# EAGLE design Transient tester r2B1 (EAGLE 6.1)
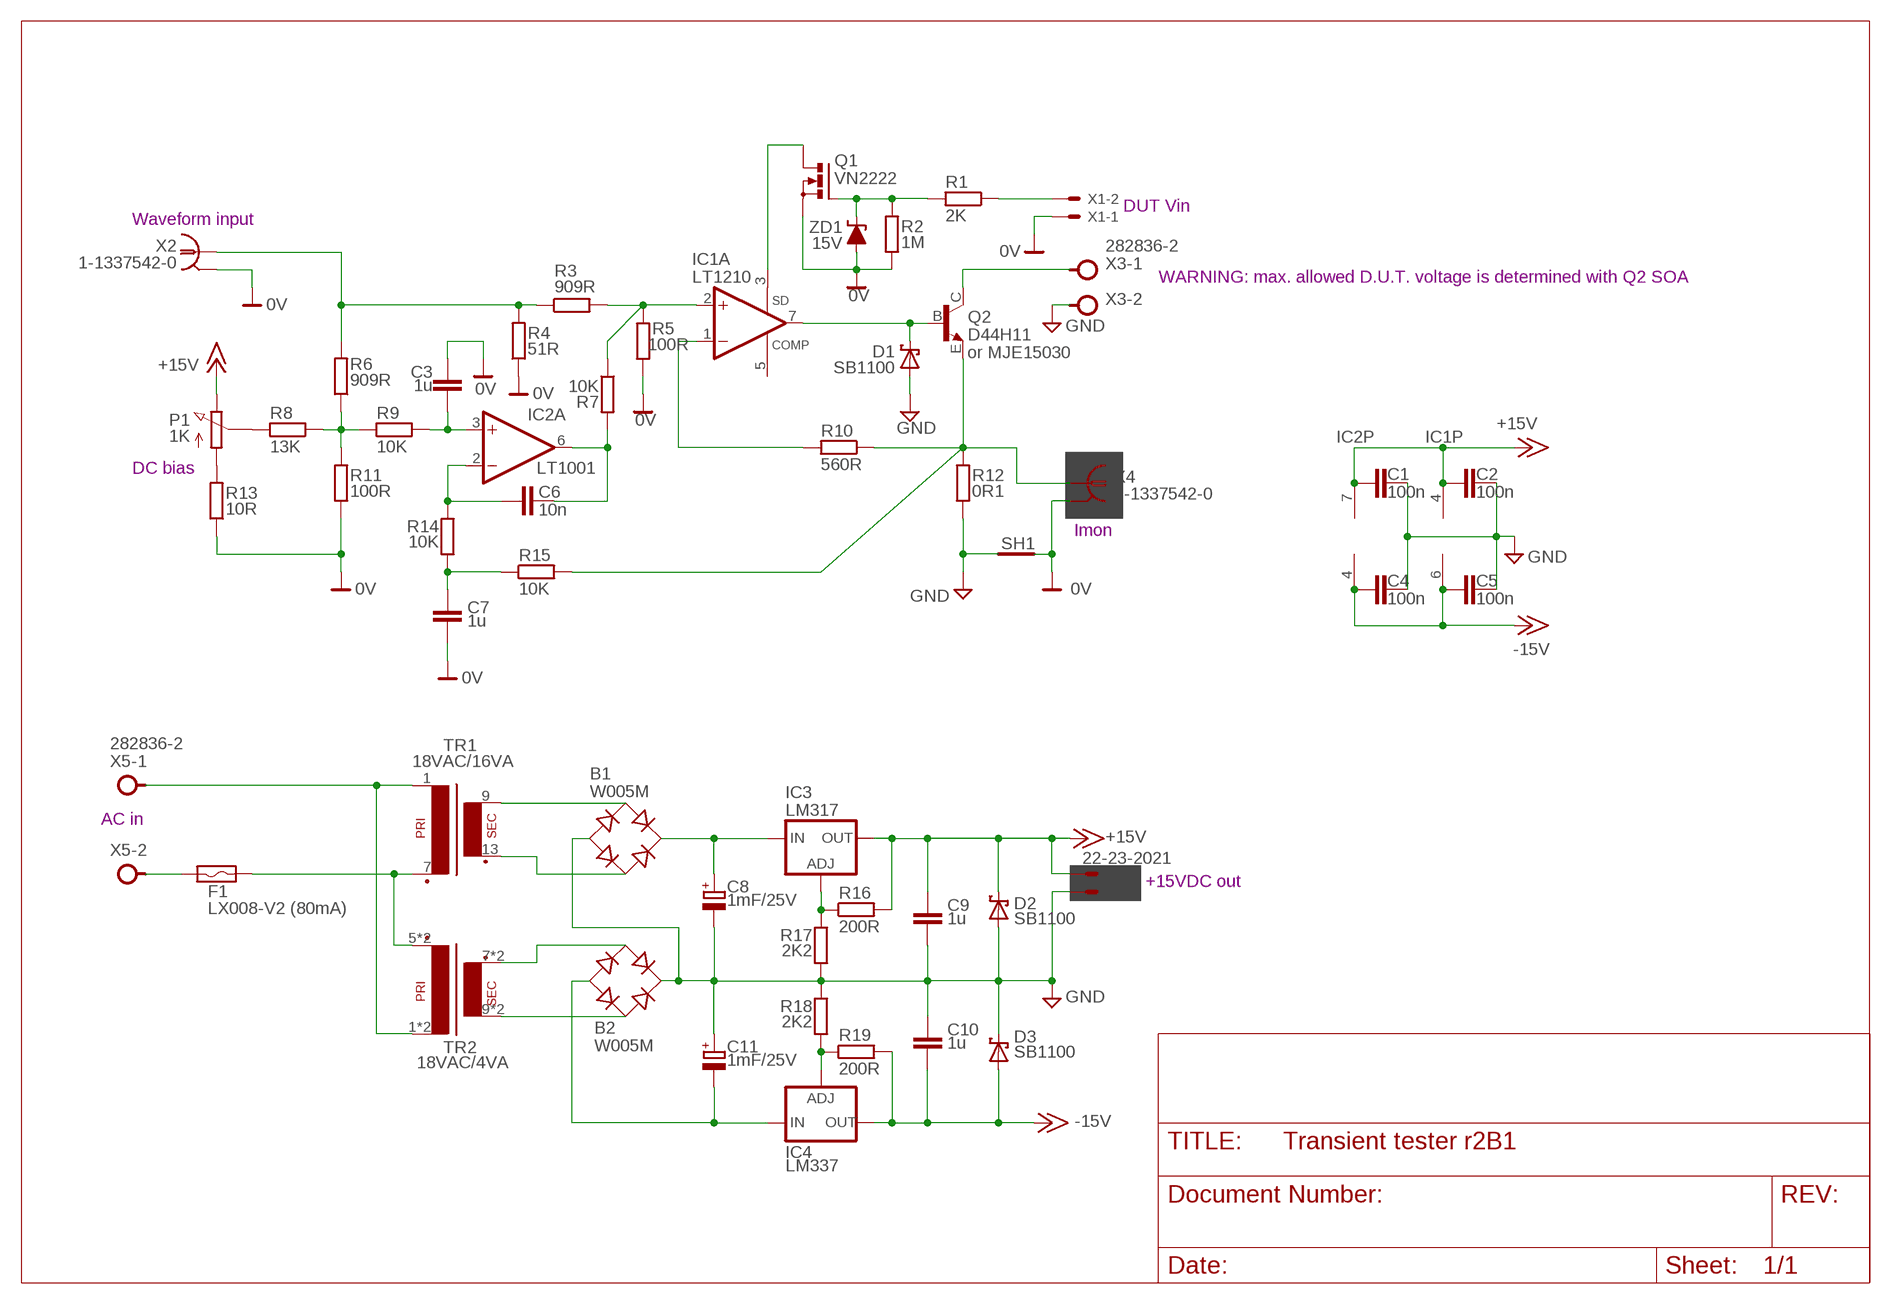
[diagram p0: schematic, sheet 1]

## Parts
B1  W005M  RECTIFIER-RB1A  [RB1A]
B2  W005M  RECTIFIER-RB1A  [RB1A]
C1  100n  C-EU050-025X075  [C050-025X075]
C2  100n  C-EU050-025X075  [C050-025X075]
C3  1u  C-EU050-075X075  [C050-075X075]
C4  100n  C-EU050-025X075  [C050-025X075]
C5  100n  C-EU050-025X075  [C050-025X075]
C6  10n  C-EU050-025X075  [C050-025X075]
C7  1u  C-EU050-075X075  [C050-075X075]
C8  1mF/25V  ECAP5G_10.5MM  [ECAP5/10.5]
C9  1u  C-EU050-025X075  [C050-025X075]
C10  1u  C-EU050-025X075  [C050-025X075]
C11  1mF/25V  ECAP5G_10.5MM  [ECAP5/10.5]
D1  SB1100  SCHOTTKY  [DO34/10]
D2  SB1100  SCHOTTKY  [DO34/10]
D3  SB1100  SCHOTTKY  [DO34/10]
F1  LX008-V2 (80mA)  FUSE_RESETTABLER7  [POLYSWITCH-R7]
IC1  LT1210  [TO220-7]
IC2  LT1001  [DIL08D]
IC3  LM317  LM317TS  [317TS]
IC4  LM337  LM337TS  [337TS]
P1  1K  POTENTIOMETER  [BOURNS_POT91]
Q1  VN2222  2N7000  [TO92-SGD]
Q2  D44H11  [TO220BV]
R1  2K  R-EU_0204/5  [0204/5]
R2  1M  R-EU_0204/5  [0204/5]
R3  909R  R-EU_0207/10  [0207/10]
R4  51R  R-EU_0204/5  [0204/5]
R5  100R  R-EU_0204/5  [0204/5]
R6  909R  R-EU_0207/10  [0207/10]
R7  10K  R-EU_0204/5  [0204/5]
R8  13K  R-EU_0204/5  [0204/5]
R9  10K  R-EU_0204/5  [0204/5]
R10  560R  R-EU_0204/5  [0204/5]
R11  100R  R-EU_0204/5  [0204/5]
R12  0R1  R_EU_OAR1+2512  [OAR1+2512]
R13  10R  R-EU_0204/5  [0204/5]
R14  10K  R-EU_0204/5  [0204/5]
R15  10K  R-EU_0204/5  [0204/5]
R16  200R  R-EU_0204/5  [0204/5]
R17  2K2  R-EU_0204/5  [0204/5]
R18  2K2  R-EU_0204/5  [0204/5]
R19  200R  R-EU_0204/5  [0204/5]
SH1  SHORTH  [SHORT_2]
TR1  18VAC/16VA  PCB_TRAFO16VA  [PCB_TRAFO16VA]
TR2  18VAC/4VA  PCB_TRAFO4VA  [PCB_TRAFO_4VA]
X1  22-23-2021  [22-23-2021]
X2  1-1337542-0  1-227161-0  [AMP_227161]
X3  282836-2  TBLOCK5.0_2A  [TBLOCK5.0_2]
X4  1-1337542-0  1-227161-0  [AMP_227161]
X5  282836-2  TBLOCK5.0_2A  [TBLOCK5.0_2]
X6  22-23-2021  [22-23-2021]
ZD1  15V  ZENER-DIODE  [DO34-ZD]

## Nets
0V: C3.1 C7.2 Q1.S R2.1 R4.1 R5.2 R11.1 R13.1 SH1.2(GND_B) X1.1 X2.2(GND) X4.2(GND) ZD1.A
+15V: C1.2 C2.2 C9.1 D2.C IC1.4(P:V+) IC2.7(P:V+) IC3.2(OUT) P1.1(E) R16.2 X6.1
-15V: C4.2 C5.2 C10.2 D3.A IC1.6(P:V-) IC2.4(P:V-) IC4.3(OUT) R19.2
GND: B1.- B2.+ C1.1 C2.1 C4.1 C5.1 C8.- C9.2 C10.1 C11.+ D1.A D2.A D3.C R12.1 R12.1.1 R17.2 R18.1 SH1.1(GND_A) X3.2 X6.2
IN2: TR1.1 TR2.1 TR2.1.1(P1) X5.1
N$1: IC1.1(A:-IN) R10.2
N$2: Q2.E R10.1 R12.2 R12.2.1 R15.2 X4.1
N$3: IC1.3(A:SD) Q1.D
N$4: Q1.G R1.2 R2.2 ZD1.C
N$5: D1.C IC1.7(A:OUT) Q2.B
N$6: IC1.2(A:+IN) R3.2 R5.1 R7.1
N$7: C6.1 IC2.6(A:OUT) R7.2
N$8: C6.2 IC2.2(A:-IN) R14.1
N$9: C7.1 R14.2 R15.1
N$10: P1.2(S) R8.2
N$11: P1.3(A) R13.2
N$12: R6.1 R8.1 R9.1 R11.2
N$13: C3.2 IC2.3(A:+IN) R9.2
N$14: R3.1 R4.2 R6.2 X2.1
N$15: B1.AC1 TR1.13(S2)
N$16: Q2.C X3.1
N$17: IC4.1(ADJ) R18.2 R19.1
N$18: F1.P$1 X5.2
N$19: B1.AC2 TR1.9(S1)
N$20: B2.AC1 TR2.7(S2) TR2.7.1(S2)
N$21: B2.- C11.- IC4.2(IN)
N$22: IC3.1(ADJ) R16.1 R17.1
N$23: B2.AC2 TR2.9(S1) TR2.9.1(S1)
N$24: R1.1 X1.2
N$25: F1.P$2 TR1.7(P2) TR2.5(P2) TR2.5.1(P2)
N$69: B1.+ C8.+ IC3.3(IN)
Unconnected: IC1.5(A:COMP) IC2.1(O:TRIM) IC2.8(O:TRIM2)

## Notes on the sheet
- DUT Vin
- Waveform input
- WARNING: max. allowed D.U.T. voltage is determined with Q2 SOA
- or MJE15030
- DC bias
- Imon
- AC in
- +15VDC out

## Library data of the parts
B1 B2 = rectifier:RECTIFIER-: Rectifier
C1-C7 C9 C10 = rcl:C-EU: CAPACITOR, European symbol
C8 C11 = MyLib6:ECAP
D1-D3 = MyLib6:SCHOTTKY
F1 = MyLib6:FUSE_RESETTABLE
IC1 = MyLib6:LT1210: 1.1A, 35MHz Current Feedback Amplifier
IC2 = MyLib6:LT1001: Precision Operational Amplifier
IC3 = v-reg:LM317TS: VOLTAGE REGULATOR
IC4 = v-reg:LM337TS: VOLTAGE REGULATOR
P1 = MyLib6:POTENTIOMETER
Q1 = MyLib6:2N7000
Q2 = MyLib6:D44H11: High Power Bipolar Transistor
R1-R11 R13-R19 = rcl:R-EU_: RESISTOR, European symbol
R12 = MyLib6:R_EU: RESISTOR - European symbol
SH1 = MyLib6:SHORT
TR1 = EEZ_Lib1:PCB_TRAFO16VA: TEZ16/D PCB transformer 16 VA
TR2 = EEZ_Lib1:PCB_TRAFO4VA: PCB treansformer MYRRA EI38x13.6, TEZ 4/D
X1 X6 = con-molex:22-23-2021: .100" (2.54mm) Center Header - 2 Pin; MF: MOLEX; MPN: 22-23-2021; OC_FARNELL: 1462926; OC_NEWARK: 25C3832
X2 X4 = MyLib6:?227161*: JACK, RIGHT ANGLE, 50 OHM, PCB, BNC Source: amp_227161.pdf; MF: TYCO ELECTRONICS; MPN: 1-227161; OC_FARNELL: unknown; OC_NEWARK: 33B3200
X3 X5 = MyLib6:TBLOCK5.0_2A
ZD1 = MyLib6:ZENER-DIODE

## Net classes
0 default: width 0.254 mm, drill 0.584 mm, clearance 0.254 mm

## Board
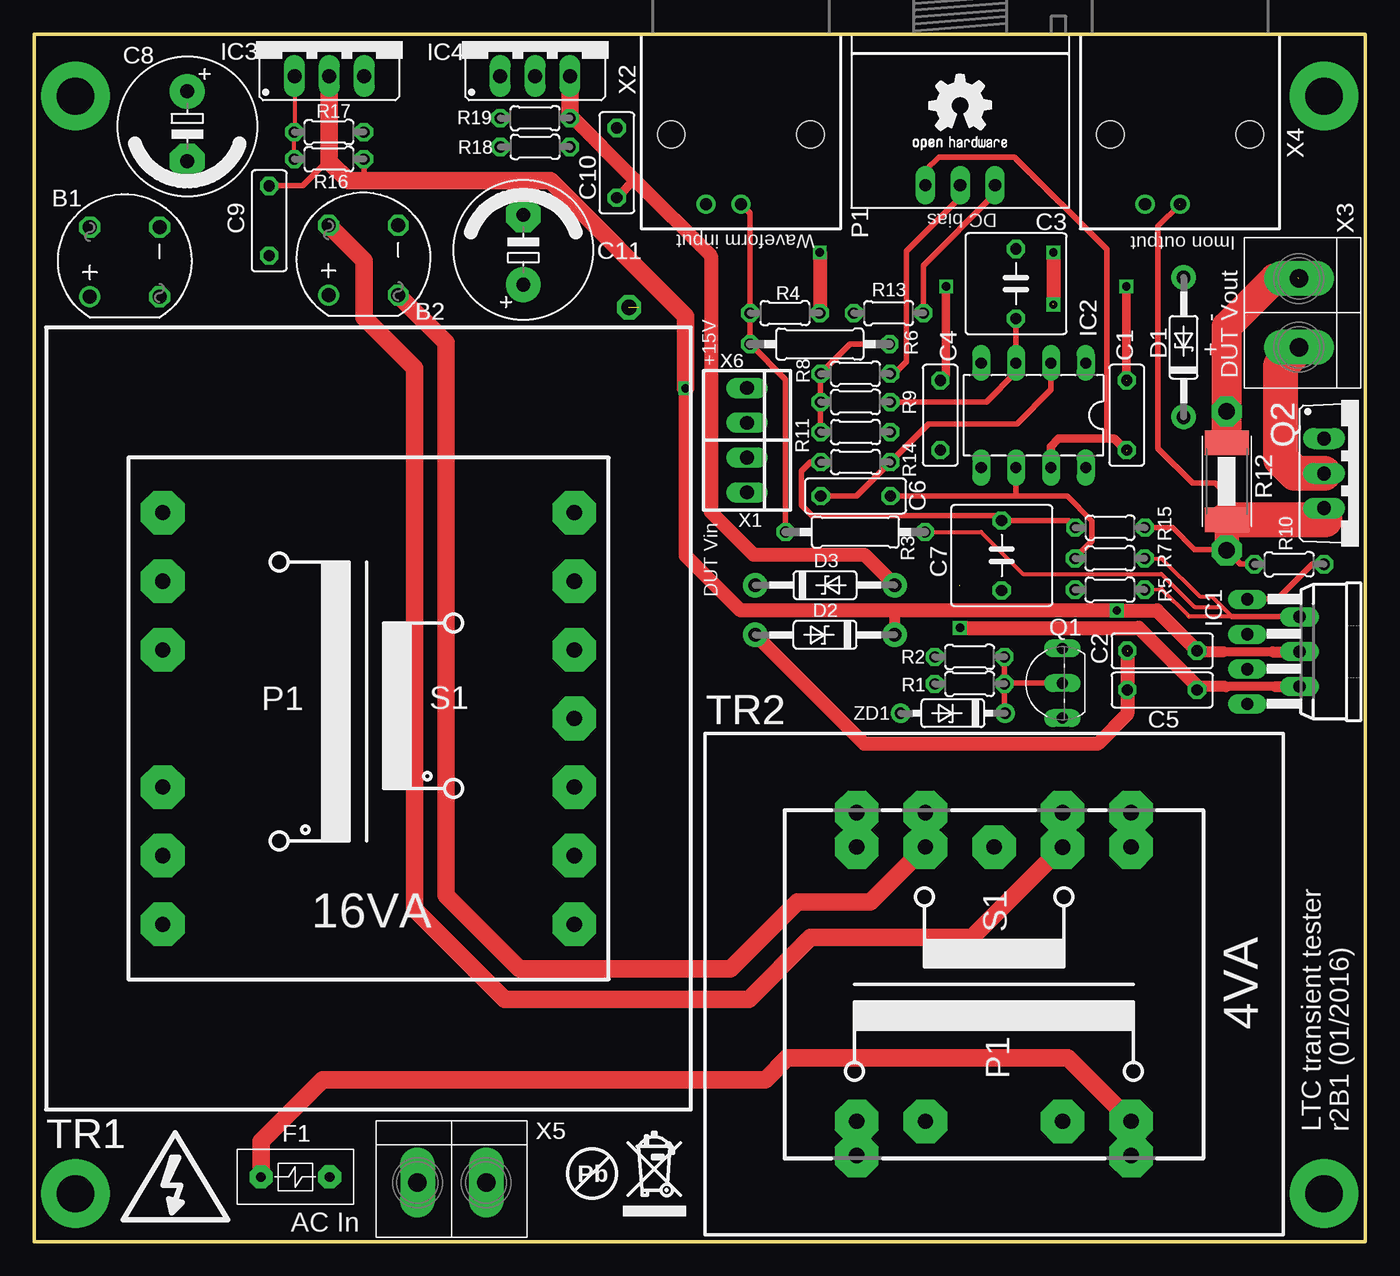
[diagram p1: board, top side]
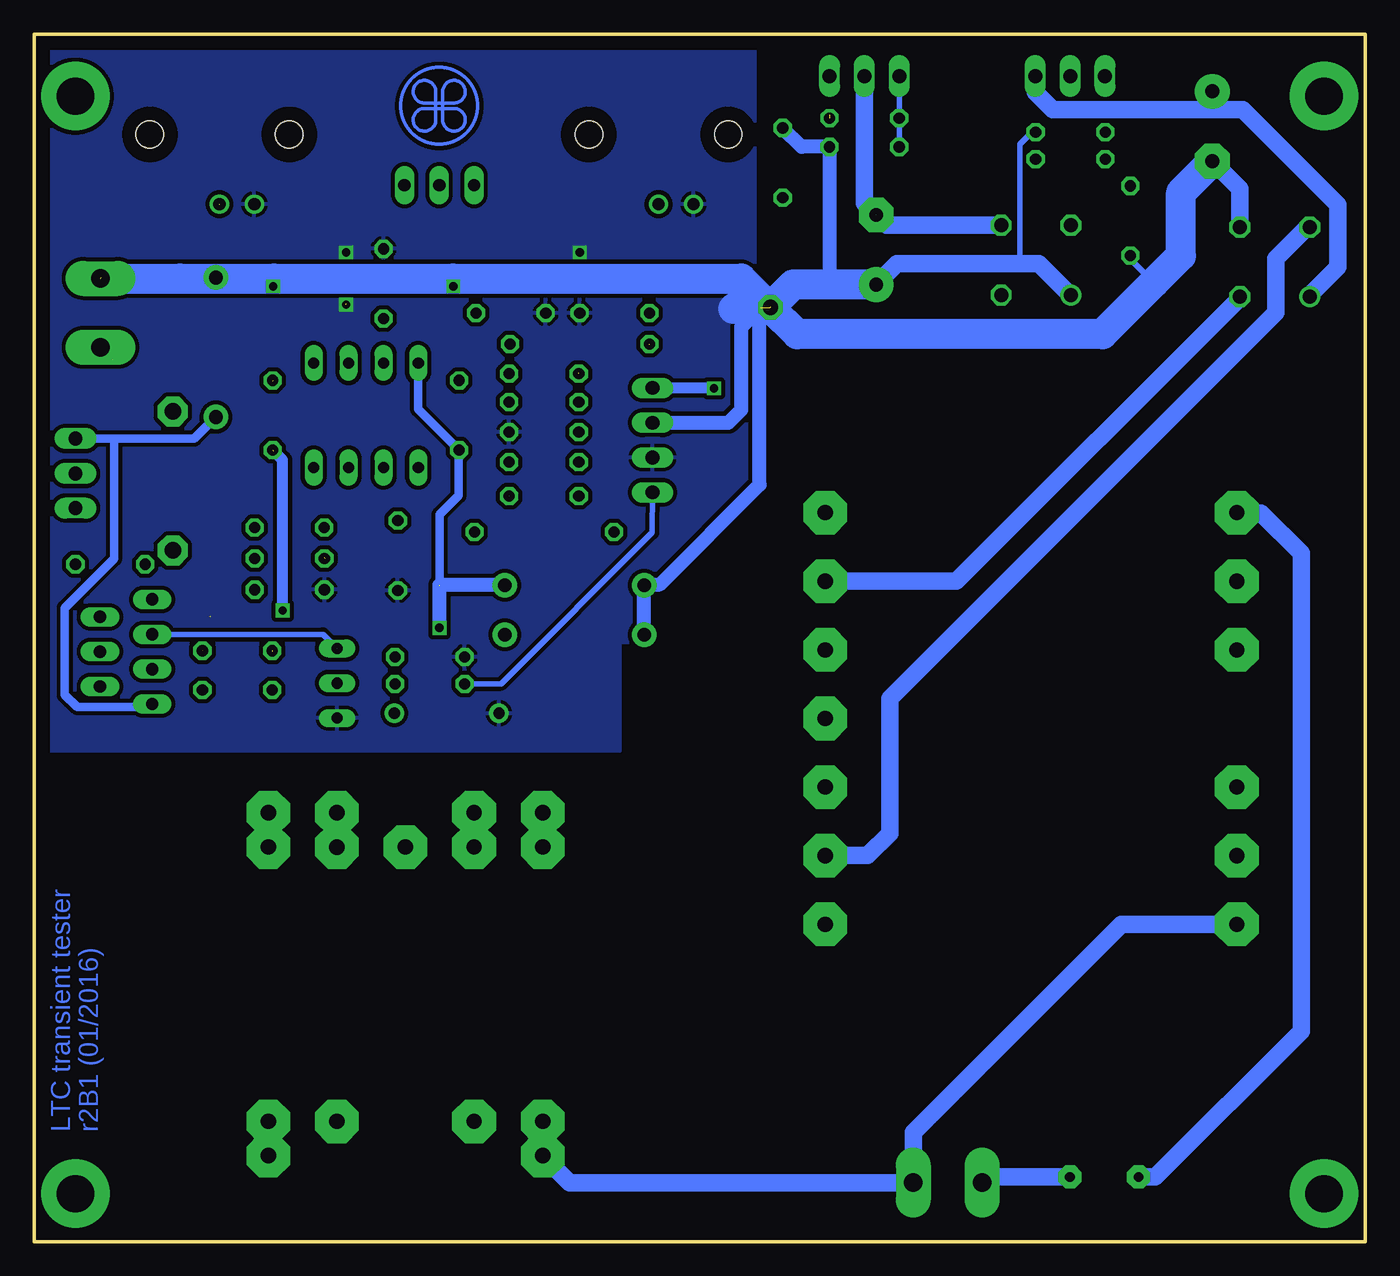
[diagram p2: board, bottom side, seen from below]

Size 97 x 88 mm. Coordinates in mm from the lower left corner, seen from the top.
Outline: 0,88 0,0 97,0 97,88 0,88
Copper layers (1*16): Top 0.035mm / dielectric 1.5mm / Bottom 0.035mm
Design rules: minimum track width 10mil, minimum drill 23mil, track to track 10mil, track to pad 10mil, pad to pad 10mil, via to via 10mil, smd to smd 10mil, copper to edge 40mil, drill to drill 8mil, minimum pad ring 10mil, minimum via ring 8mil, stop-mask expansion 4mil, vias tented up to drill 25mil, thermal gap 10mil

### Footprints (pad centres in the part's own frame; a part is rotated, then mirrored left to right if it is on the bottom)
RB1A = drill 1.016: + -2.54,2.54 | drill 1.016 octagon: - 2.54,-2.54; AC1 2.54,2.54; AC2 -2.54,-2.54
C050-025X075 = drill 0.813 octagon: 1 -2.54,0; 2 2.54,0
C050-075X075 = drill 0.813 octagon: 1 -2.54,0; 2 2.54,0
ECAP5/10.5 = drill 1.016 pad 2.54: + -2.54,0 | drill 1.016 pad 2.54 octagon: - 2.54,0
DO34/10 = drill 1 pad 1.778: A 5.08,0; C -5.08,0
POLYSWITCH-R7 = drill 0.7 pad 1.676 octagon: P$1 -2.5,0; P$2 2.5,0
TO220-7 = drill 0.9 long: 1 -3.81,-4.59; 2 -2.54,-0.78; 3 -1.27,-4.59; 4 0,-0.78; 5 1.27,-4.59; 6 2.54,-0.78; 7 3.81,-4.59
DIL08D = drill 0.813 long: 1 -3.81,-3.81; 2 -1.27,-3.81; 3 1.27,-3.81; 4 3.81,-3.81; 5 3.81,3.81; 6 1.27,3.81; 7 -1.27,3.81; 8 -3.81,3.81
317TS = drill 1.016 long: 1 -2.54,-2.54; 2 0,-2.54; 3 2.54,-2.54
337TS = drill 1.016 long: 1 -2.54,-2.54; 2 0,-2.54; 3 2.54,-2.54
BOURNS_POT91 = drill 0.9 long: 1 2.54,11.049; 2 0,11.049; 3 -2.54,11.049
TO92-SGD = drill 0.813 long: D -2.54,0; G 0,0; S 2.54,0
TO220BV = drill 1.016 long: B -2.54,0; C 0,0; E 2.54,0
0204/5 = drill 0.813 octagon: 1 -2.54,0; 2 2.54,0
0207/10 = drill 0.813 octagon: 1 -5.08,0; 2 5.08,0
OAR1+2512 = smd 1.8 x 3.2: 1 -2.8,0; 2 2.8,0 | drill 1.2 pad 2.184 octagon: 1.1 -5.08,0; 2.1 5.04,0
SHORT_2 = drill 1.1 pad 1.778 octagon: 1 0,0; 2 0,0
PCB_TRAFO16VA = drill 1.1 pad 3.175 octagon: 1 -15,-15; 2 -15,-10; 3 -15,-5; 5 -15,5; 6 -15,10; 7 -15,15; 8 15,15; 9 15,10; 10 15,5; 11 15,0; 12 15,-5; 13 15,-10; 14 15,-15
PCB_TRAFO_4VA = drill 1.118 pad 3.175 octagon: 1 -12.5,10; 1.1 -10,10; 2 -10,5; 4 -10,-5; 5 -12.5,-10; 5.1 -10,-10; 6 12.5,-10; 6.1 10,-10; 7 12.497,-4.993; 7.1 9.997,-4.993; 8 10,0; 9 12.5,5; 9.1 10,5; 10 12.5,10; 10.1 10,10
22-23-2021 = drill 1 long: 1 -1.27,0; 2 1.27,0
AMP_227161 = drill 0.9 pad 1.27: 1 0,-5.08; 2 -2.54,-5.08 | hole 2: -5.08,0; 5.08,0
TBLOCK5.0_2 = drill 1.35 pad 2.54 long: 1 0,0; 2 0,-5
DO34-ZD = drill 0.813 pad 1.422: A 3.81,0; C -3.81,0

### Placement (x,y rotation side)
B1  6.59,71.41 90 top
B2  23.99,71.54 90 top
C1  79.62,60.23 270 top
C2  82.2,43.07 0 top
C3  71.55,69.82 270 top
C4  66.03,60.23 270 top
C5  82.2,40.21 0 top
C6  59.85,54.34 180 top
C7  70.5,50.01 270 top
C8  11.15,81.3 270 top
C9  17.12,74.41 270 top
C10  42.45,78.63 270 top
C11  35.64,72.3 90 top
D1  83.76,65.19 90 top
D2  57.63,44.23 180 top
D3  57.63,47.85 0 top
EEZ_SIGNATURE1  SIGNATURESMALL  [SIGNATURE_5MM]  67.49,82.79 180 top
F1  19.02,4.72 180 top
GOLD_ORB_SM  OSHWLOGO_GOLD_ORB_SM  [OSHW2]  63.66,78.52 0 top
IC1  93,43 270 top
IC2  72.82,60.23 180 top
IC3  21.5,87.5 0 top
IC4  36.5,87.5 0 top
P1  67.48,88.05 180 top
Q1  74.93,40.7 270 top
Q2  94,56 270 top
R1  68.17,40.66 0 top
R2  68.17,42.63 0 top
R3  59.84,51.72 0 top
R4  54.71,67.68 180 top
R5  78.39,47.52 180 top
R6  57.25,65.42 180 top
R7  78.39,49.8 180 top
R8  59.85,63.26 0 top
R9  59.85,61.2 0 top
R10  91.46,49.37 0 top
R11  59.85,59.01 180 top
R12  86.9,55.42 270 top
R13  62.27,67.68 0 top
R14  59.85,56.82 180 top
R15  78.41,52.04 0 top
R16  21.48,78.9 0 top
R17  21.48,80.87 0 top
R18  36.5,79.79 180 top
R19  36.5,81.89 0 top
SH1  43.34,68.09 90 top
TR1  24.36,38.13 0 top
TR2  69.95,18.77 90 top
U$2  [RECYCLE_BIN1/8]  42.91,1.86 0 top
U$3  [PB_SMALL]  40.65,4.96 0 top
X1  51.94,55.88 270 top
X2  51.5,80.7 0 top
X3  92.17,65.2 180 top
X4  83.5,80.7 0 top
X5  32.93,4.31 270 top
X6  51.94,60.96 270 top
ZD1  66.95,38.52 180 top

### Tracks (layer width: path | path; a pad name or v marks a point on that pad's centre or on a via)
0V  (via drill 0.6)  (1 unrouted)
  Top 1.016: 74.27,71.98 74.27,68.36 | v57.25,72.11 57.25,67.66
  Bottom 2.184: SH1.2 45.96,68.09 46.07,67.98
  other vias: 74.27,72.11 74.27,68.3
  pour Bottom (isolate 0.305): 44.48,88.49 97.51,88.49 97.51,35.78 54.33,35.78 54.33,43.72 44.48,43.72
+15V  (via drill 0.6)  (2 unrouted)
  Top 0.406: C9.1 19.55,76.95 21.5,78.9 | R16.2 24.02,77.49 23.85,77.31 | P1.1 64.94,78.09 65.91,79.06 71.44,79.06 78.17,72.33 78.17,58.52
  Top 0.61: IC2.7 74.09,57.96 74.65,58.52 78.17,58.52 78.71,58.52 79.6,57.63
  Top 0.66: 90.24,42.99 86.69,42.99
  Top 0.813: D2.C 62.71,45.95 62.65,46.01 | 90.24,42.99 92.21,42.99 IC1.4 | 86.69,42.99 84.83,42.99 C2.2
  Top 1.016: 84.74,43.09 81.82,46.01 v78.9,46.01 62.65,46.01 51.47,46.01 47.47,50.01 v47.47,62.2 | 84.79,43.02 C2.2
  Top 1.27: IC3.2 21.5,78.9 21.5,78.71 22.89,77.31 23.85,77.31 37.63,77.31 47.47,67.47 v47.47,62.2
  Bottom 0.813: v78.9,46.01 78.9,56.98 C1.2 | v47.47,62.2 51.91,62.2 X6.1
-15V  (via drill 0.6)  (2 unrouted)
  Top 0.61: C10.2 42.45,76.11 43.76,77.41 43.79,77.44
  Top 0.66: 90.47,40.46 86.85,40.46
  Top 0.813: 90.47,40.46 IC1.6 | 86.85,40.46 84.99,40.46 C5.2
  Top 1.016: v67.47,44.74 80.49,44.74 84.74,40.48 C5.2 | 39.04,82.12 43.76,77.41 49.31,71.85 49.31,53.18 52.42,50.07 60.49,50.07 D3.A
  Top 1.27: IC4.3 39.04,82.12
  Bottom 0.61: IC2.4 69.01,60.68 C4.2 66.08,57.65 66.08,54.39 67.47,52.99 67.47,47.85
  Bottom 1.016: D3.A 67.47,47.85 | v67.47,44.74 67.47,47.79 67.34,47.91 67.41,47.91
GND  (via drill 0.6)  (6 unrouted)
  Top 0.406: C5.1 79.66,43.02
  Top 0.61: v79.6,69.63 79.6,62.77 | C4.1 66.08,62.77 66.46,63.15 v66.46,69.63
  Top 1.016: 79.66,43.02 79.66,38.45 77.5,36.29 60.49,36.29 D2.A
  Top 1.27: R12.1 86.9,58.52
  Top 2.184: 86.9,58.52 R12.1.1 86.9,66.7 90.39,70.2 X3.2
  Bottom 0.305: D1.A 86.32,70.27 86.39,70.2 | v79.6,69.63 79.6,70.13
  Bottom 0.406: C9.2 17.12,71.6 15.4,69.89 | R17.2 24.29,80.87 25.18,79.98 25.18,71.79 24.67,71.28 | v66.46,69.63 66.46,70.17 66.48,70.2
  Bottom 0.61: 79.6,70.13 79.54,70.2
  Bottom 1.016: D2.A D3.C 52.49,47.91 51.4,47.91 44.13,55.18 44.13,67.3 SH1.1 42.77,67.52 | C10.1 41.07,79.79 R18.1 39.04,69.84 38.96,69.76 | X6.2 46.42,59.69 45.47,60.64 45.47,66.67 44.07,68.07
  Bottom 1.27: B2.+ 21.5,69 23.78,71.28 24.67,71.28 34.12,71.28 C11.+ | B1.- 9.13,76.74 C8.-
  Bottom 2.184: C8.- 13.43,76.47 13.43,71.85 15.4,69.89 19.15,66.14 41.39,66.14 SH1.1 | X3.2 86.39,70.2 79.54,70.2 66.48,70.2 45.49,70.2 43.37,68.07 | 90.78,70.2 92.05,70.2 92.11,70.27 | C11.+ 38.96,69.76 41.69,69.76 43.34,68.11
HOLE1  (via drill 2.7 pad 5)
  other vias: 3,83.5
HOLE2  (via drill 2.7 pad 5)
  other vias: 94,83.5
HOLE3  (via drill 2.7 pad 5)
  other vias: 3,3.5
HOLE4  (via drill 2.7 pad 5)
  other vias: 94,3.5
IN2
  Bottom 1.27: TR1.1 17.77,23.13 32.93,7.97 X5.1 57.99,4.31 TR2.1 TR2.1.1
N$1
  Top 0.406: R10.2 93.13,49.37 90.59,46.83 88.86,46.83 IC1.1
N$2  (1 unrouted)
  Top 0.305: 94.09,52.62 94.09,53.37 Q2.E
  Top 0.406: R12.2 86.9,54.45 86.08,55.28 84.43,55.28 81.89,57.82 81.89,74.01 83.47,75.6 | R10.1 87.91,49.37 R12.2.1 86.83,50.45 84.55,50.45 82.97,52.04 R15.2
  Top 1.778: R12.2 R12.2.1
  Top 2.54: R12.2 94.09,52.62
N$3  (1 unrouted)
  Bottom 0.406: IC1.3 75.96,44.27 Q1.D
N$4
  Top 0.406: R2.2 R1.2 | Q1.G 70.76,40.7 R1.2 | R1.2 70.71,38.56 ZD1.C
N$5
  Bottom 0.61: Q2.B 92.24,58.53 91.25,58.53 | 91.25,58.53 85.34,58.53 D1.C | 88.43,38.96 93.89,38.96 94.78,39.85 94.78,46.19 94.2,46.77 93.44,47.53 91.19,49.78 91.19,58.47 91.25,58.53
  Bottom 0.711: IC1.7 88.41,38.98 88.43,38.96
N$6  (1 unrouted)
  Top 0.305: R3.2 69,51.72 72.04,48.67 82.14,48.67 84.55,46.26 86.58,46.26 | 84.17,45.56 87.28,45.56 86.58,46.26 | 86.58,46.26 85.82,47.02 84.93,47.02 82.16,49.8 R7.1 | R5.1 82.15,47.58 84.14,45.59
  Top 0.406: 87.28,45.56 92.65,45.56 IC1.2
N$7  (2 unrouted)
  Top 0.406: 62.39,54.33 71.56,54.33 | 71.56,54.33 75.28,54.33 77.09,52.51 77.09,51.05 75.88,49.85 | IC2.6 71.55,54.34 71.56,54.33
N$8
  Top 0.406: IC2.2 74.09,62.09 71.6,59.6 65.17,59.6 R14.1 59.92,54.34 C6.2
N$9
  Top 0.406: R14.2 56.57,56.82 55.91,56.17 55.91,53.69 56.68,52.93 70.2,52.93 70.5,52.63 C7.1 75.36,52.55 R15.1
N$10
  Top 0.406: R8.2 62.69,63.26 63.56,64.14 63.56,72.2 67.48,76.12 P1.2
N$11
  Top 0.406: R13.2 64.81,71.15 70.03,76.37 P1.3
N$12  (1 unrouted)
  Top 0.406: R11.2 R9.1 R8.1 | R6.1 59.45,65.42 57.34,63.31
N$13
  Top 0.406: R9.2 69.39,61.2 71.55,63.36 IC2.3 C3.2
N$14  (1 unrouted)
  Top 0.406: R3.1 54.76,62.85 52.2,65.41 | R6.2 R4.2 52.17,74.95 X2.1
N$15
  Bottom 1.27: B1.AC1 4.23,73.95 6.51,71.66 6.51,67.72 34.64,39.59 34.64,29.75 36.26,28.13 TR1.13
N$16  (1 unrouted)
  Top 2.54: Q2.C 91.9,55.99 90.84,57.06 90.84,63.85 91.28,64.3 | 91.28,64.31 X3.1
N$17
  Bottom 0.406: IC4.1 R19.1 R18.2
N$18
  Bottom 1.27: F1.P$1 27.52,4.72 X5.2
N$19
  Bottom 1.27: B1.AC2 9.13,68.79 29.79,48.13 TR1.9
N$20
  Top 1.27: B2.AC1 24.04,71.49 24.04,67.34 27.72,63.66 27.72,24.22 34.29,17.65 52.07,17.65 56.58,22.16 68.34,22.16 TR2.7.1 TR2.7
N$21  (1 unrouted)
  Bottom 1.27: IC4.2 36.5,75.7 C11.- | B2.- 34.9,74.08 35.66,74.84
N$22
  Top 0.305: IC3.1 18.96,80.89 R17.1 R16.1
N$23
  Top 1.27: B2.AC2 30.01,65.52 30.01,25.24 35.37,19.88 50.74,19.88 55.63,24.77 60.95,24.77 TR2.9.1 TR2.9
N$24
  Bottom 0.406: X1.2 51.96,51.68 62.98,40.66 R1.1
N$25
  Top 1.27: F1.P$2 16.52,7.31 21.02,11.81 53.28,11.81 54.86,13.4 75.32,13.4 TR2.5.1 TR2.5
  Bottom 1.27: F1.P$2 15.29,4.72 4.67,15.34 4.67,50.2 7.59,53.12 9.34,53.12 TR1.7
N$69
  Bottom 1.27: B1.+ 4.05,68.98 2,71.03 2,75.6 8.93,82.52 11.34,82.52 | IC3.3 24.04,83.79 22.77,82.52 11.34,82.52 | C8.+ 11.15,82.71 11.34,82.52

### Text on the board
Bottom: r2B1 (01/2016) | LTC transient tester
tPlace: DC bias | Waveform input | Imon output | + - | +15V | DUT Vout | DUT Vin | LTC transient tester | r2B1 (01/2016) | AC In
_tNames: IC3 | IC4 | C8 | X2 | R17 | R19 | R18 | X4 | R16 | C9 | C10 | B1 | P1 | C3 | X3 | C11 | R4 | R13 | B2 | IC2 | R6 | X6 | C4 | C1 | D1 | R8 | R9 | R11 | Q2 | R12 | R14 | C6 | X1 | C7 | R15 | R3 | R10 | D3 | R7 | R5 | D2 | IC1 | Q1 | R2 | C2 | R1 | ZD1 | TR2 | C5 | TR1 | F1 | X5